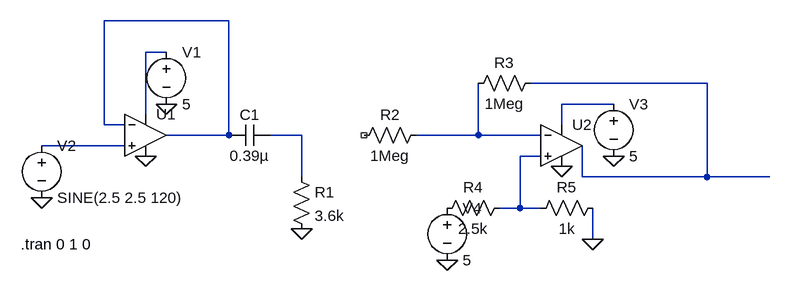
[diagram p0: schematic draft.asc]
draft.asc, the LTspice schematic file:
Version 4
SHEET 1 1108 680
WIRE 272 -32 80 -32
WIRE 176 16 144 16
WIRE 1008 64 736 64
WIRE 864 96 784 96
WIRE 144 112 144 16
WIRE 80 128 80 -32
WIRE 112 128 80 128
WIRE 784 128 784 96
WIRE 272 144 272 -32
WIRE 272 144 176 144
WIRE 384 144 336 144
WIRE 656 144 656 64
WIRE 656 144 560 144
WIRE 752 144 656 144
WIRE 112 160 -16 160
WIRE 752 176 720 176
WIRE 384 208 384 144
WIRE 816 208 816 160
WIRE 1008 208 1008 64
WIRE 1008 208 816 208
WIRE 1104 208 1008 208
WIRE 720 256 720 176
WIRE 720 256 688 256
WIRE 752 256 720 256
WIRE 832 304 832 256
FLAG 144 176 0
FLAG 176 96 0
FLAG 384 288 0
FLAG -16 240 0
FLAG 784 192 0
FLAG 864 176 0
FLAG 832 304 0
FLAG 608 336 0
SYMBOL OpAmps\\UniversalOpamp2 144 144 R0
SYMATTR InstName U1
SYMBOL voltage 176 0 R0
WINDOW 123 0 0 Left 0
WINDOW 39 0 0 Left 0
SYMATTR InstName V1
SYMATTR Value 5
SYMBOL cap 336 128 R90
WINDOW 0 0 32 VBottom 2
WINDOW 3 32 32 VTop 2
SYMATTR InstName C1
SYMATTR Value 0.39µ
SYMBOL res 368 192 R0
SYMATTR InstName R1
SYMATTR Value 3.6k
SYMBOL voltage -16 144 R0
WINDOW 123 0 0 Left 0
WINDOW 39 0 0 Left 0
SYMATTR InstName V2
SYMATTR Value SINE(2.5 2.5 120)
SYMBOL res 576 128 R90
WINDOW 0 0 56 VBottom 2
WINDOW 3 32 56 VTop 2
SYMATTR InstName R2
SYMATTR Value 1Meg
SYMBOL res 752 48 R90
WINDOW 0 0 56 VBottom 2
WINDOW 3 32 56 VTop 2
SYMATTR InstName R3
SYMATTR Value 1Meg
SYMBOL OpAmps\\UniversalOpamp2 784 160 R0
SYMATTR InstName U2
SYMBOL voltage 864 80 R0
WINDOW 123 0 0 Left 0
WINDOW 39 0 0 Left 0
SYMATTR InstName V3
SYMATTR Value 5
SYMBOL res 704 240 R90
WINDOW 0 0 56 VBottom 2
WINDOW 3 32 56 VTop 2
SYMATTR InstName R4
SYMATTR Value 2.5k
SYMBOL res 848 240 R90
WINDOW 0 0 56 VBottom 2
WINDOW 3 32 56 VTop 2
SYMATTR InstName R5
SYMATTR Value 1k
SYMBOL voltage 608 240 R0
WINDOW 123 0 0 Left 0
WINDOW 39 0 0 Left 0
SYMATTR InstName V4
SYMATTR Value 5
TEXT -48 312 Left 2 !.tran 0 1 0

The netlist it stands for:
* draft.asc
XU1 N007 N001 N002 0 N001 level.2 Avol=1Meg GBW=10Meg Slew=10Meg ilimit=25m rail=0 Vos=0 phimargin=45 en=0 enk=0 in=0 ink=0 Rin=500Meg  ; pins IN+ IN- V+ V- OUT
V1 N002 0 5
C1 N005 N001 0.39µ
R1 N005 0 3.6k
V2 N007 0 SINE(2.5 2.5 120)
R2 N006 NC_01 1Meg
R3 N003 N006 1Meg
XU2 N008 N006 N004 0 N003 level.2 Avol=1Meg GBW=10Meg Slew=10Meg ilimit=25m rail=0 Vos=0 phimargin=45 en=0 enk=0 in=0 ink=0 Rin=500Meg  ; pins IN+ IN- V+ V- OUT
V3 N004 0 5
R4 N008 P001 2.5k
R5 0 N008 1k
V4 P001 0 5
.tran 0 1 0
.lib UniversalOpamps2.sub
.backanno
.end